# EAGLE schematic Kicker (EAGLE 8.0.2)
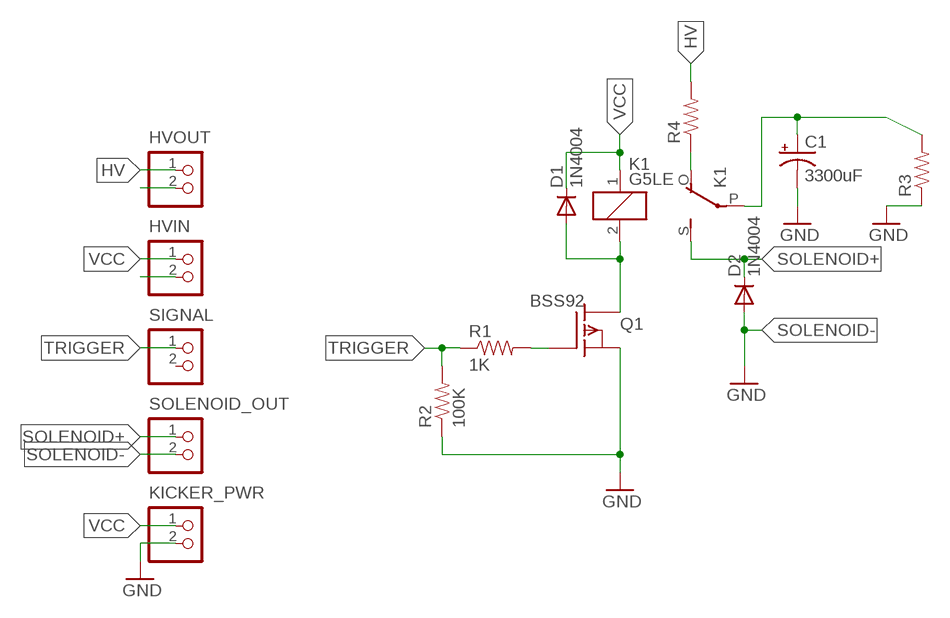
[diagram p0: schematic, sheet 1]

## Parts
C1  3300uF  CPOL-USE10-22.5  [EB22,5D]
D1  1N4004  [DO41-10]
D2  1N4004  [DO41-10]
HVIN  B2P-VH  [B2P-VH]
HVOUT  B2P-VH  [B2P-VH]
K1  G5LE  [G5LE]
KICKER_PWR  B2P-VH  [B2P-VH]
Q1  BSS92  [TO92]
R1  1K  RESISTOR0603  [0603-RES]
R2  100K  RESISTOR0805-RES  [0805]
R3  RESISTORPTH-2W  [AXIAL-0.8]
R4  RESISTORPTH-2W  [AXIAL-0.8]
SIGNAL  B2B-PH-K-S  [B2B-PH-K-S]
SOLENOID_OUT  B2P-VH  [B2P-VH]

## Nets
GND: C1.- KICKER_PWR.2 Q1.3(S) R2.1 R3.P$1
HV: HVOUT.1 R4.P$2
N$1: K1.O(2:O) R4.P$1
N$2: Q1.1(G) R1.2
N$3: D1.A K1.2 Q1.2(D)
N$4: HVOUT.2
N$5: C1.+ K1.P(2:P) R3.P$2
N$7: HVIN.2
SOLENOID+: D2.C K1.S(2:S) SOLENOID_OUT.1
SOLENOID-: D2.A SOLENOID_OUT.2 ; supply symbol labelled GND
TRIGGER: R1.1 R2.2 SIGNAL.1
VCC: D1.C HVIN.1 K1.1 KICKER_PWR.1
Unconnected: SIGNAL.2

## Library data of the parts
C1 = rcl:CPOL-US: POLARIZED CAPACITOR, American symbol
D1 D2 = diode:1N4004: DIODE general purpose rectifier, 1 A
HVIN HVOUT KICKER_PWR SOLENOID_OUT = jst-vh:B2P-VH: Wire-to-Board 3.96mm pitch top mount connector Source: http://www.jst-mfg.com/product/pdf/jpn/VH.pdf http://www.jst-mfg.com/product/detail.php?series=262
K1 = relay:G5LE: RELAY 1 x switch, 10 A/120 V AC, 8 A/30 V DC, Omron; OC_FARNELL: unknown; OC_NEWARK: unknown
Q1 = transistor-fet:BSS92: P-Channel Enhancement MOSFET -200V; -0,15A; 11Ohm
R1-R4 = SparkFun-Resistors:RESISTOR: Resistor Basic schematic elements and footprints for 0603, 1206, and PTH resistors.
SIGNAL = jst-ph:B2B-PH-*: Wire-to-Board 2.0mm pitch top mount connector Source: http://www.jst-mfg.com/product/pdf/jpn/PH.pdf http://www.jst-mfg.com/product/detail.php?series=199